# EAGLE schematic rain ALARM (EAGLE 6.5.0)
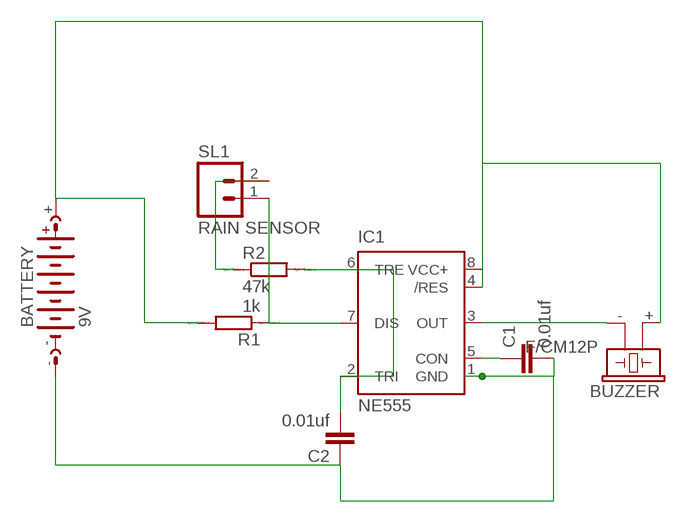
[diagram p0: schematic, sheet 1]

## Parts
BATTERY  9V  AB9V  [AB9V]
BUZZER  F/CM12P  [F/CM12P]
C1  0.01uf  C2.5/5  [C2.5-5]
C2  0.01uf  C2.5/5  [C2.5-5]
IC1  NE555  [DIL-08]
R1  1k  R0204/7  [0204/7]
R2  47k  R0204/7  [0204/7]
SL1  RAIN SENSOR  M02  [02P]

## Nets
N$1: BUZZER.- IC1.3(OUT)
N$2: BATTERY.- C1.2 C2.1 IC1.1(GND)
N$3: IC1.7(DIS) R1.1 SL1.1
N$5: BATTERY.+ BUZZER.+ IC1.4(/RES) IC1.8(VCC+) R1.2
N$6: C1.1 IC1.5(CON)
N$7: C2.2 IC1.2(TRI) IC1.6(TRE) R2.2
N$8: R2.1 SL1.2

## Library data of the parts
BATTERY = battery:AB9V: 9-V BATTERY CLIP
BUZZER = buzzer:F/CM12P: BUZZER Source: Buerklin; OC_FARNELL: unknown; OC_NEWARK: unknown
C1 C2 = capacitor-wima:C: CAPACITOR naming: grid - package width
IC1 = st-microelectronics:NE555: General purpose bipolar Timer; MF: Arrow Electronics; MPN: NE555N; OC_FARNELL: 1467742; OC_NEWARK: 89K1486
R1 R2 = eagle-ltspice:R: RESISTOR, European symbol; SPICEMODEL: NONE; SPICEPREFIX: R
SL1 = con-amp-quick:M02: AMP QUICK CONNECTOR; OC_FARNELL: unknown; OC_NEWARK: unknown